# Altium schematic sheet #NIP涡轮驱动板-1.SchDoc
size A3
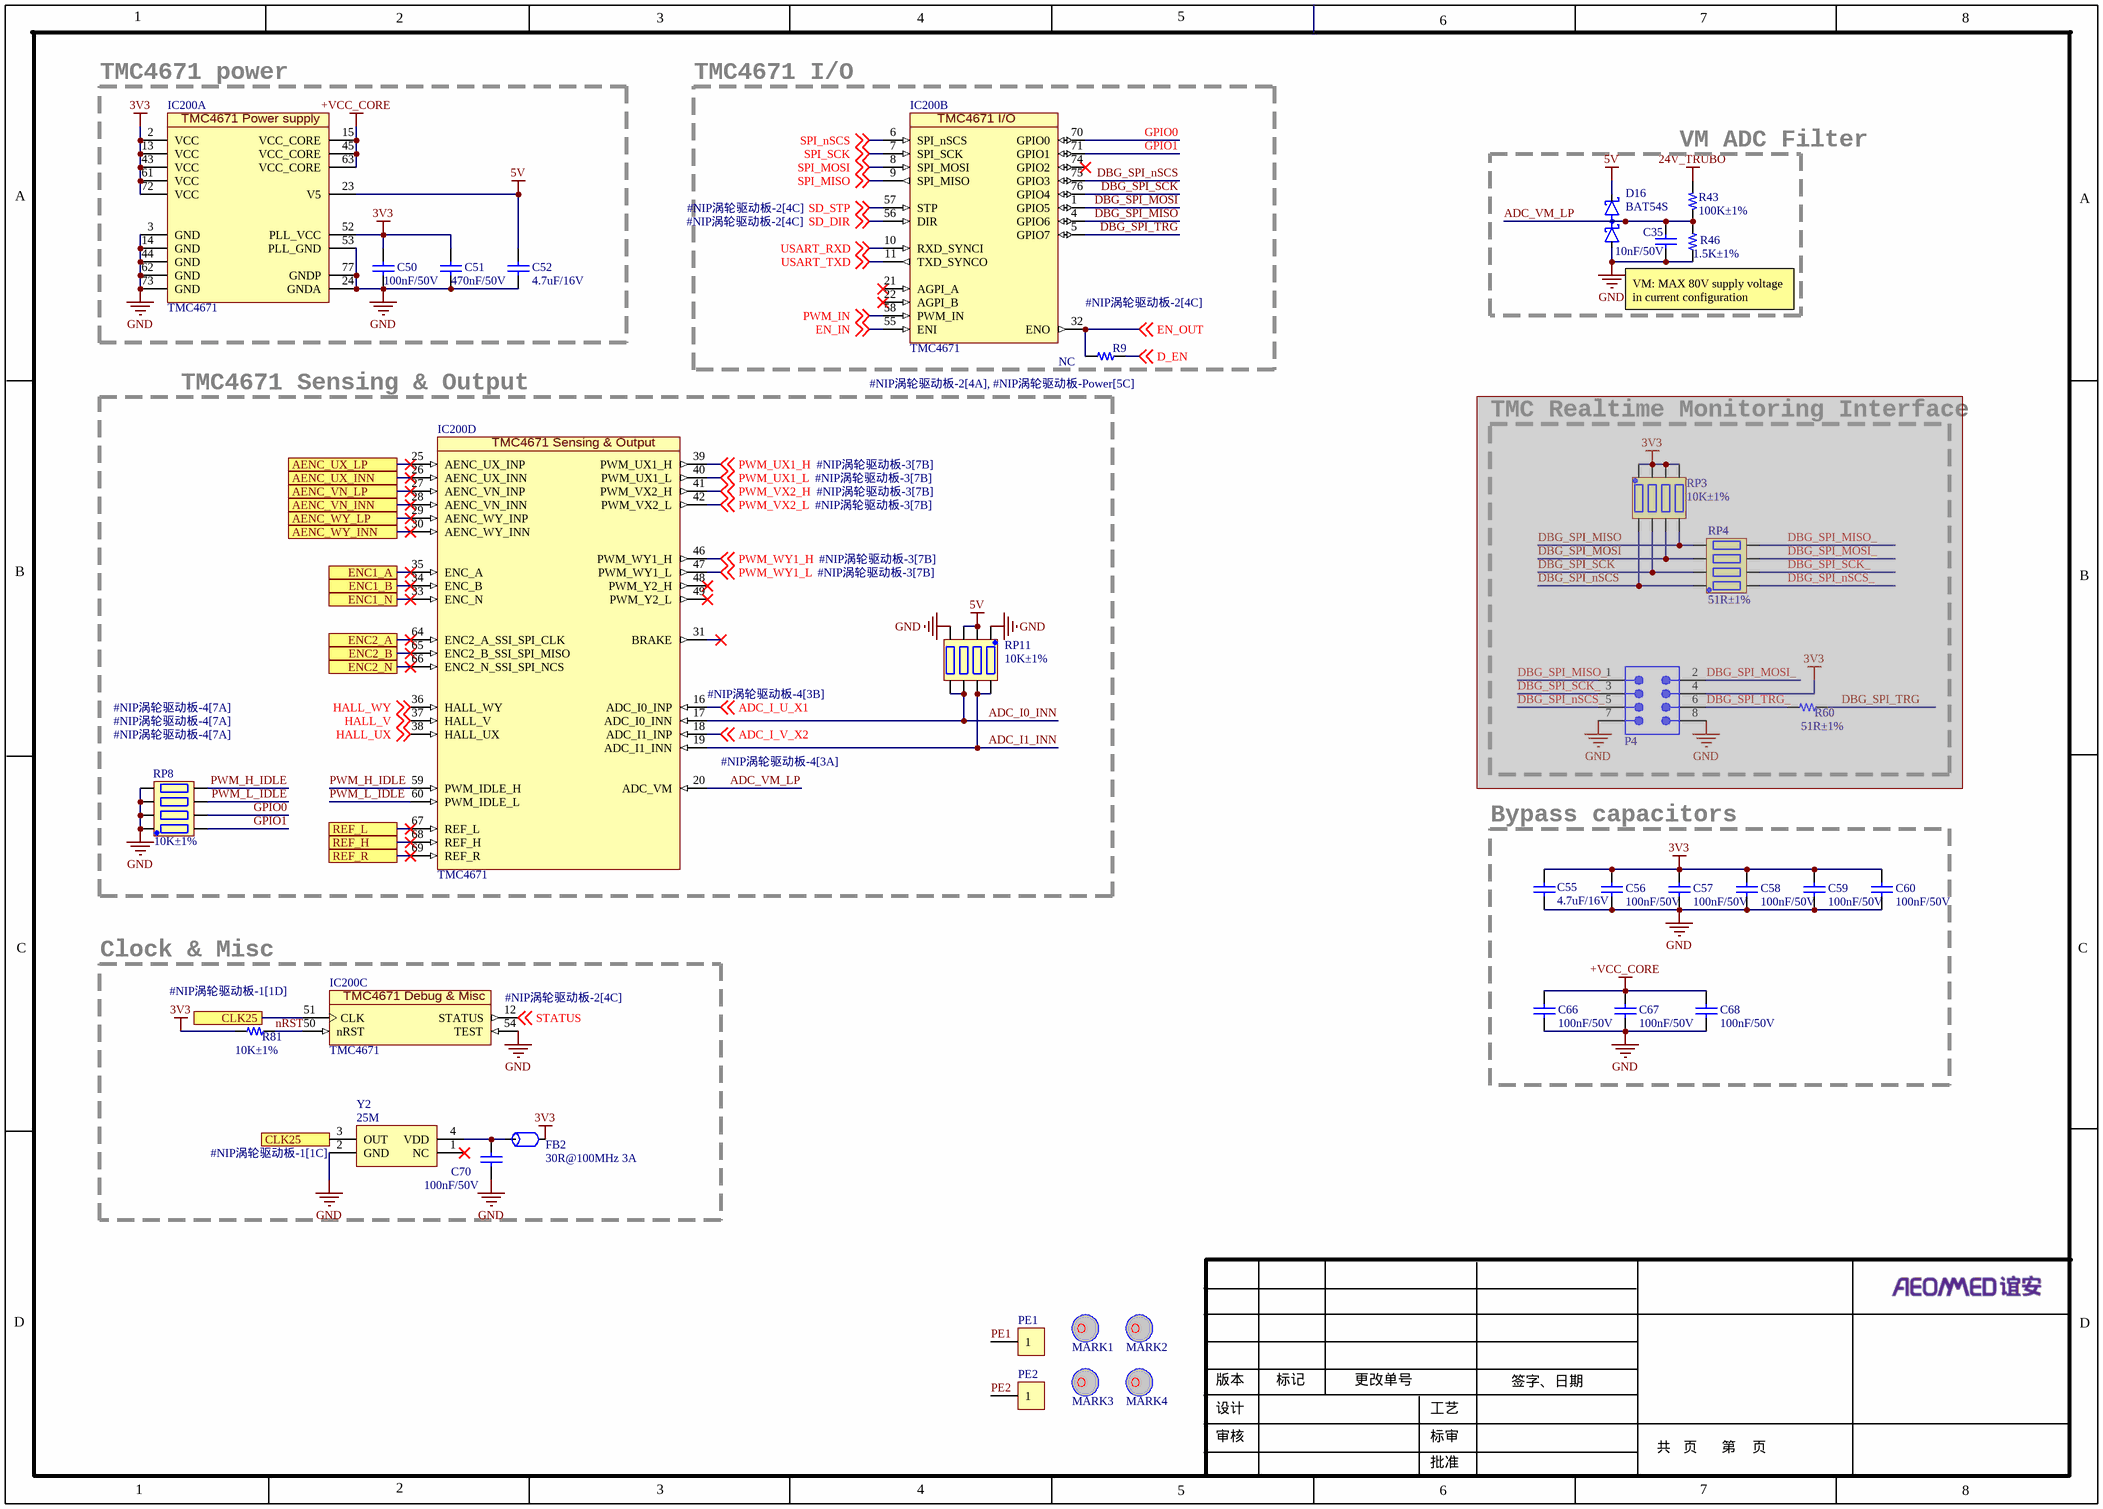
[diagram p0: #NIP涡轮驱动板-1.SchDoc]

## Parts
C35  10nF/50V  [C0402]
C50  100nF/50V  [C0402]
C51  470nF/50V  [C-0603]
C52  4.7uF/16V  [C-0805]
C55  4.7uF/16V  [C-0603]
C56  100nF/50V  [C0402]
C57  100nF/50V  [C0402]
C58  100nF/50V  [C0402]
C59  100nF/50V  [C0402]
C60  100nF/50V  [C0402]
C66  100nF/50V  [C0402]
C67  100nF/50V  [C0402]
C68  100nF/50V  [C0402]
C70  100nF/50V  [C-0603]
D16  BAT54S  [SOT23-3]
FB2  30R@100MHz 3A  [FB-0603]
IC200  TMC4671  [QFN40P1050X650X90_HS-77N]  (parts A,B,C,D of 5)
MARK1  MARK_POINT  [MARK_POINT]  (value not drawn)
MARK2  MARK_POINT  [MARK_POINT]  (value not drawn)
MARK3  MARK_POINT  [MARK_POINT]  (value not drawn)
MARK4  MARK_POINT  [MARK_POINT]  (value not drawn)
P4  62100821921  [HDR-TH_8P-P2.00-V-M-R2-C2-S2.00]  (value not drawn)  (masked out: inside a compile mask, not in the netlist)
PE1  (no value)  [固定孔-M3]
PE2  (no value)  [固定孔-M3]
R9  NC  [R0402]
R43  100K±1%  [R0402]
R46  1.5K±1%  [R0402]
R60  51R±1%  [R0402]  (masked out: inside a compile mask, not in the netlist)
R81  10K±1%  [R0402]
RP3  10K±1%  [RES-ARRAY-SMD_0402-8P-L2.0-W1.0-BL]  (masked out: inside a compile mask, not in the netlist)
RP4  51R±1%  [RES-ARRAY-SMD_0402-8P-L2.0-W1.0-BL]  (masked out: inside a compile mask, not in the netlist)
RP8  10K±1%  [RES-ARRAY-SMD_0402-8P-L2.0-W1.0-BL]
RP11  10K±1%  [RES-ARRAY-SMD_0402-8P-L2.0-W1.0-BL]
Y2  25M  [Y-X32F_JFVNY]

## Blocks framed on the sheet
TMC4671 power: C50-C52 IC200
TMC4671 I/O: IC200 R9
VM ADC Filter: C35 D16 R43 R46
TMC4671 Sensing & Output: IC200 RP8 RP11
TMC Realtime Monitoring Interface: P4 R60 RP3 RP4
Bypass capacitors: C55-C60 C66-C68
Clock & Misc: C70 FB2 IC200 R81 Y2

## Ports
AENC_UX_INN, AENC_UX_LP, AENC_VN_INN, AENC_VN_LP, AENC_WY_INN, AENC_WY_LP, CLK25 (see #NIP涡轮驱动板-1[1C]), CLK25 (see #NIP涡轮驱动板-1[1D]), ENC1_A, ENC1_B, ENC1_N, ENC2_A, ENC2_B, ENC2_N, REF_H, REF_L, REF_R

## Nets
3V3: C50.2 C51.2 C55.1 C56.2 C57.2 C58.2 C59.2 C60.2 FB2.2 IC200.2(VCC) IC200.13(VCC) IC200.43(VCC) IC200.52(PLL_VCC) IC200.61(VCC) IC200.72(VCC) R81.1
5V: C52.2 D16.2(C2) IC200.23(V5) RP11.2 RP11.3
24V_TRUBO: R43.2
+VCC_CORE: C66.2 C67.2 C68.2 IC200.15(VCC_CORE) IC200.45(VCC_CORE) IC200.63(VCC_CORE)
GND: C35.1 C50.1 C51.1 C52.1 C55.2 C56.1 C57.1 C58.1 C59.1 C60.1 C66.1 C67.1 C68.1 C70.2 D16.1(A1) IC200.3(GND) IC200.14(GND) IC200.24(GNDA) IC200.44(GND) IC200.53(PLL_GND) IC200.54(TEST) IC200.62(GND) IC200.73(GND) IC200.77(GNDP) R46.1 RP8.1 RP8.2 RP8.3 RP8.4 RP11.1 RP11.4 Y2.2(GND)
ADC_I0_INN: IC200.17(ADC_I0_INN) RP11.5 RP11.6
ADC_I1_INN: IC200.19(ADC_I1_INN) RP11.7 RP11.8
ADC_I_U_X1: IC200.16(ADC_I0_INP) ; off-sheet ADC_I_U_X1
ADC_I_V_X2: IC200.18(ADC_I1_INP) ; off-sheet ADC_I_V_X2
ADC_VM_LP: C35.2 D16.3(C1A2) IC200.20(ADC_VM) R43.1 R46.2
AENC_UX_INN: IC200.26(AENC_UX_INN) ; port AENC_UX_INN
AENC_UX_LP: IC200.25(AENC_UX_INP) ; port AENC_UX_LP
AENC_VN_INN: IC200.28(AENC_VN_INN) ; port AENC_VN_INN
AENC_VN_LP: IC200.27(AENC_VN_INP) ; port AENC_VN_LP
AENC_WY_INN: IC200.30(AENC_WY_INN) ; port AENC_WY_INN
AENC_WY_LP: IC200.29(AENC_WY_INP) ; port AENC_WY_LP
CLK25: IC200.51(CLK) Y2.3(OUT) ; port CLK25
D_EN: R9.2 ; off-sheet D_EN
DBG_SPI_MISO: IC200.4(GPIO6)
DBG_SPI_MOSI: IC200.1(GPIO5)
DBG_SPI_nSCS: IC200.75(GPIO3)
DBG_SPI_SCK: IC200.76(GPIO4)
DBG_SPI_TRG: IC200.5(GPIO7)
EN_IN: IC200.55(ENI) ; off-sheet EN_IN
EN_OUT: IC200.32(ENO) R9.1 ; off-sheet EN_OUT
ENC1_A: IC200.35(ENC_A) ; port ENC1_A
ENC1_B: IC200.34(ENC_B) ; port ENC1_B
ENC1_N: IC200.33(ENC_N) ; port ENC1_N
ENC2_A: IC200.64(ENC2_A_SSI_SPI_CLK) ; port ENC2_A
ENC2_B: IC200.65(ENC2_B_SSI_SPI_MISO) ; port ENC2_B
ENC2_N: IC200.66(ENC2_N_SSI_SPI_NCS) ; port ENC2_N
GPIO0: IC200.70(GPIO0) RP8.7
GPIO1: IC200.71(GPIO1) RP8.8
HALL_UX: IC200.38(HALL_UX) ; off-sheet HALL_UX
HALL_V: IC200.37(HALL_V) ; off-sheet HALL_V
HALL_WY: IC200.36(HALL_WY) ; off-sheet HALL_WY
nRST: IC200.50(nRST) R81.2
PE1: PE1.1
PE2: PE2.1
PWM_H_IDLE: IC200.59(PWM_IDLE_H) RP8.5
PWM_IN: IC200.58(PWM_IN) ; off-sheet PWM_IN
PWM_L_IDLE: IC200.60(PWM_IDLE_L) RP8.6
PWM_UX1_H: IC200.39(PWM_UX1_H) ; off-sheet PWM_UX1_H
PWM_UX1_L: IC200.40(PWM_UX1_L) ; off-sheet PWM_UX1_L
PWM_VX2_H: IC200.41(PWM_VX2_H) ; off-sheet PWM_VX2_H
PWM_VX2_L: IC200.42(PWM_VX2_L) ; off-sheet PWM_VX2_L
PWM_WY1_H: IC200.46(PWM_WY1_H) ; off-sheet PWM_WY1_H
PWM_WY1_L: IC200.47(PWM_WY1_L) ; off-sheet PWM_WY1_L
REF_H: IC200.68(REF_H) ; port REF_H
REF_L: IC200.67(REF_L) ; port REF_L
REF_R: IC200.69(REF_R) ; port REF_R
SD_DIR: IC200.56(DIR) ; off-sheet SD_DIR
SD_STP: IC200.57(STP) ; off-sheet SD_STP
SPI_MISO: IC200.9(SPI_MISO) ; off-sheet SPI_MISO
SPI_MOSI: IC200.8(SPI_MOSI) ; off-sheet SPI_MOSI
SPI_nSCS: IC200.6(SPI_nSCS) ; off-sheet SPI_nSCS
SPI_SCK: IC200.7(SPI_SCK) ; off-sheet SPI_SCK
STATUS: IC200.12(STATUS) ; off-sheet STATUS
USART_RXD: IC200.10(RXD_SYNCI) ; off-sheet USART_RXD
USART_TXD: IC200.11(TXD_SYNCO) ; off-sheet USART_TXD
NetC70_1: C70.1 FB2.1 Y2.4(VDD)

Not connected (* = marked no-connect by the designer): IC200 21(AGPI_A)* 22(AGPI_B)* 31(BRAKE)* 48(PWM_Y2_H)* 49(PWM_Y2_L)* 74(GPIO2)*; Y2 1(NC)*

## Notes on the sheet
- VM: MAX 80V supply voltage in current configuration
- 1
- 2
- 3
- 4
- 5
- 6
- 7
- 8
- A
- B
- C
- D
- 版本
- 标记
- 更改单号
- 签字、日期
- 设计
- 审核
- 工艺
- 标审
- 共   页      第    页
- 批准
- (in symbol TMC4671, part A) TMC4671 Power supply
- (in symbol TMC4671, part B) TMC4671 I/O
- (in symbol TMC4671, part C) TMC4671 Debug & Misc
- (in symbol TMC4671, part D) TMC4671 Sensing & Output

## Library data of the parts
C35 C50 C51 C56-C60 C66-C68 C70 = C-0603: 物料编号: *; 物料名称: *; 厂家: *; 详细描述: *
C52 C55 = C-0805
D16 = BAT54S: 品牌：NXP，型号：BAT54S，0.11A,30V，ROHS; MF: NXP; MPN: BAT54S
FB2 = FB-0603: 品牌：TDK，型号：MPZ1608S601A , 600 ohm@100MHz ，1 A，25%，ROHS
IC200 = TMC4671: MF: TRINAMIC; MPN: TMC4671
P4 = 62100821921: WR-PHD Pin Header, SMT, Vertical, pitch 2mm, 2 Row, 8P; Manufacturer: Wurth Elektronik; Contact Resistance: 20mΩ; Rated Current: 2A; Working Voltage: 200V; Withstanding Voltage: 500V; ComponentLink1Description: Website Link; ComponentLink1URL: https://www.we-online.com/redexpert/article/62100821921?ad; ComponentLink2Description: Datasheet Link; ComponentLink2URL: https://www.we-online.com/redexpert/spec/62100821921?ad; Manufacturer Part Number: 62100821921; Category: Board-to-Board Connectors; Match Code: WR-PHD; Mount: Surface Mount; Operating Temperature Max: 105°C; Operating Temperature Min: -40°C; Packaging: Tube; Gender: Pin Header; Number of Pins: 8; Number of Rows: 2; Orientation: Vertical; Pitch: 2mm
PE1 PE2 = CON1: Connector
R9 R43 R46 R60 R81 = R-0603
RP3 RP4 RP8 RP11 = RP-0603
Y2 = Y-X32F_JFVNY: 品牌：TAITIEN,型号：（OX系列）OXETELJANF-25.000000，尺寸：3.2 x 2.5mm; 制造商: TAITIEN